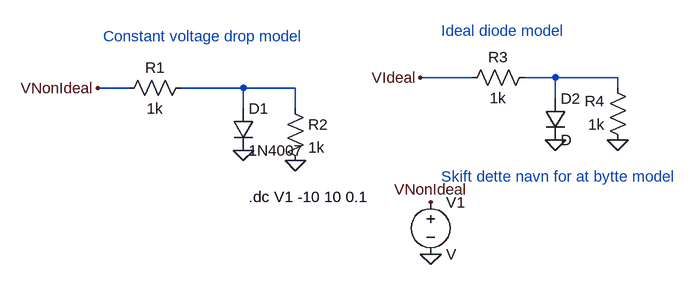
[diagram p0: schematic diodeDet.asc]
diodeDet.asc, the LTspice schematic file:
Version 4
SHEET 1 900 680
WIRE 544 80 464 80
WIRE 672 80 624 80
WIRE 768 80 672 80
WIRE 16 96 -32 96
WIRE 192 96 96 96
WIRE 272 96 192 96
WIRE 768 96 768 80
WIRE 672 112 672 80
WIRE 192 128 192 96
WIRE 272 128 272 96
FLAG 192 192 0
FLAG 272 208 0
FLAG 672 176 0
FLAG 768 176 0
FLAG 480 352 0
FLAG 480 272 VNonIdeal
FLAG -32 96 VNonIdeal
FLAG 464 80 VIdeal
SYMBOL diode 176 128 R0
SYMATTR InstName D1
SYMATTR Value 1N4007
SYMBOL res 256 112 R0
SYMATTR InstName R2
SYMATTR Value 1k
SYMBOL res 112 80 R90
WINDOW 0 0 56 VBottom 2
WINDOW 3 32 56 VTop 2
SYMATTR InstName R1
SYMATTR Value 1k
SYMBOL res 640 64 R90
WINDOW 0 0 56 VBottom 2
WINDOW 3 32 56 VTop 2
SYMATTR InstName R3
SYMATTR Value 1k
SYMBOL res 784 192 R180
WINDOW 0 36 76 Left 2
WINDOW 3 36 40 Left 2
SYMATTR InstName R4
SYMATTR Value 1k
SYMBOL diode 656 112 R0
SYMATTR InstName D2
SYMBOL voltage 480 256 R0
SYMATTR InstName V1
TEXT 200 264 Left 2 !.dc V1 -10 10 0.1
TEXT -24 16 Left 2 ;Constant voltage drop model
TEXT 496 8 Left 2 ;Ideal diode model
TEXT 496 232 Left 2 ;Skift dette navn for at bytte model

The netlist it stands for:
* diodeDet.asc
D1 N002 0 1N4007
R2 N002 0 1k
R1 N002 VNonIdeal 1k
R3 N001 VIdeal 1k
R4 0 N001 1k
D2 N001 0 D
V1 VNonIdeal 0 V
.model D D
.lib standard.dio
.dc V1 -10 10 0.1
* Constant voltage drop model
* Ideal diode model
* Skift dette navn for at bytte model
.backanno
.end